# EAGLE design vending-machine-v2-optosensor-r1 (EAGLE 5.11)
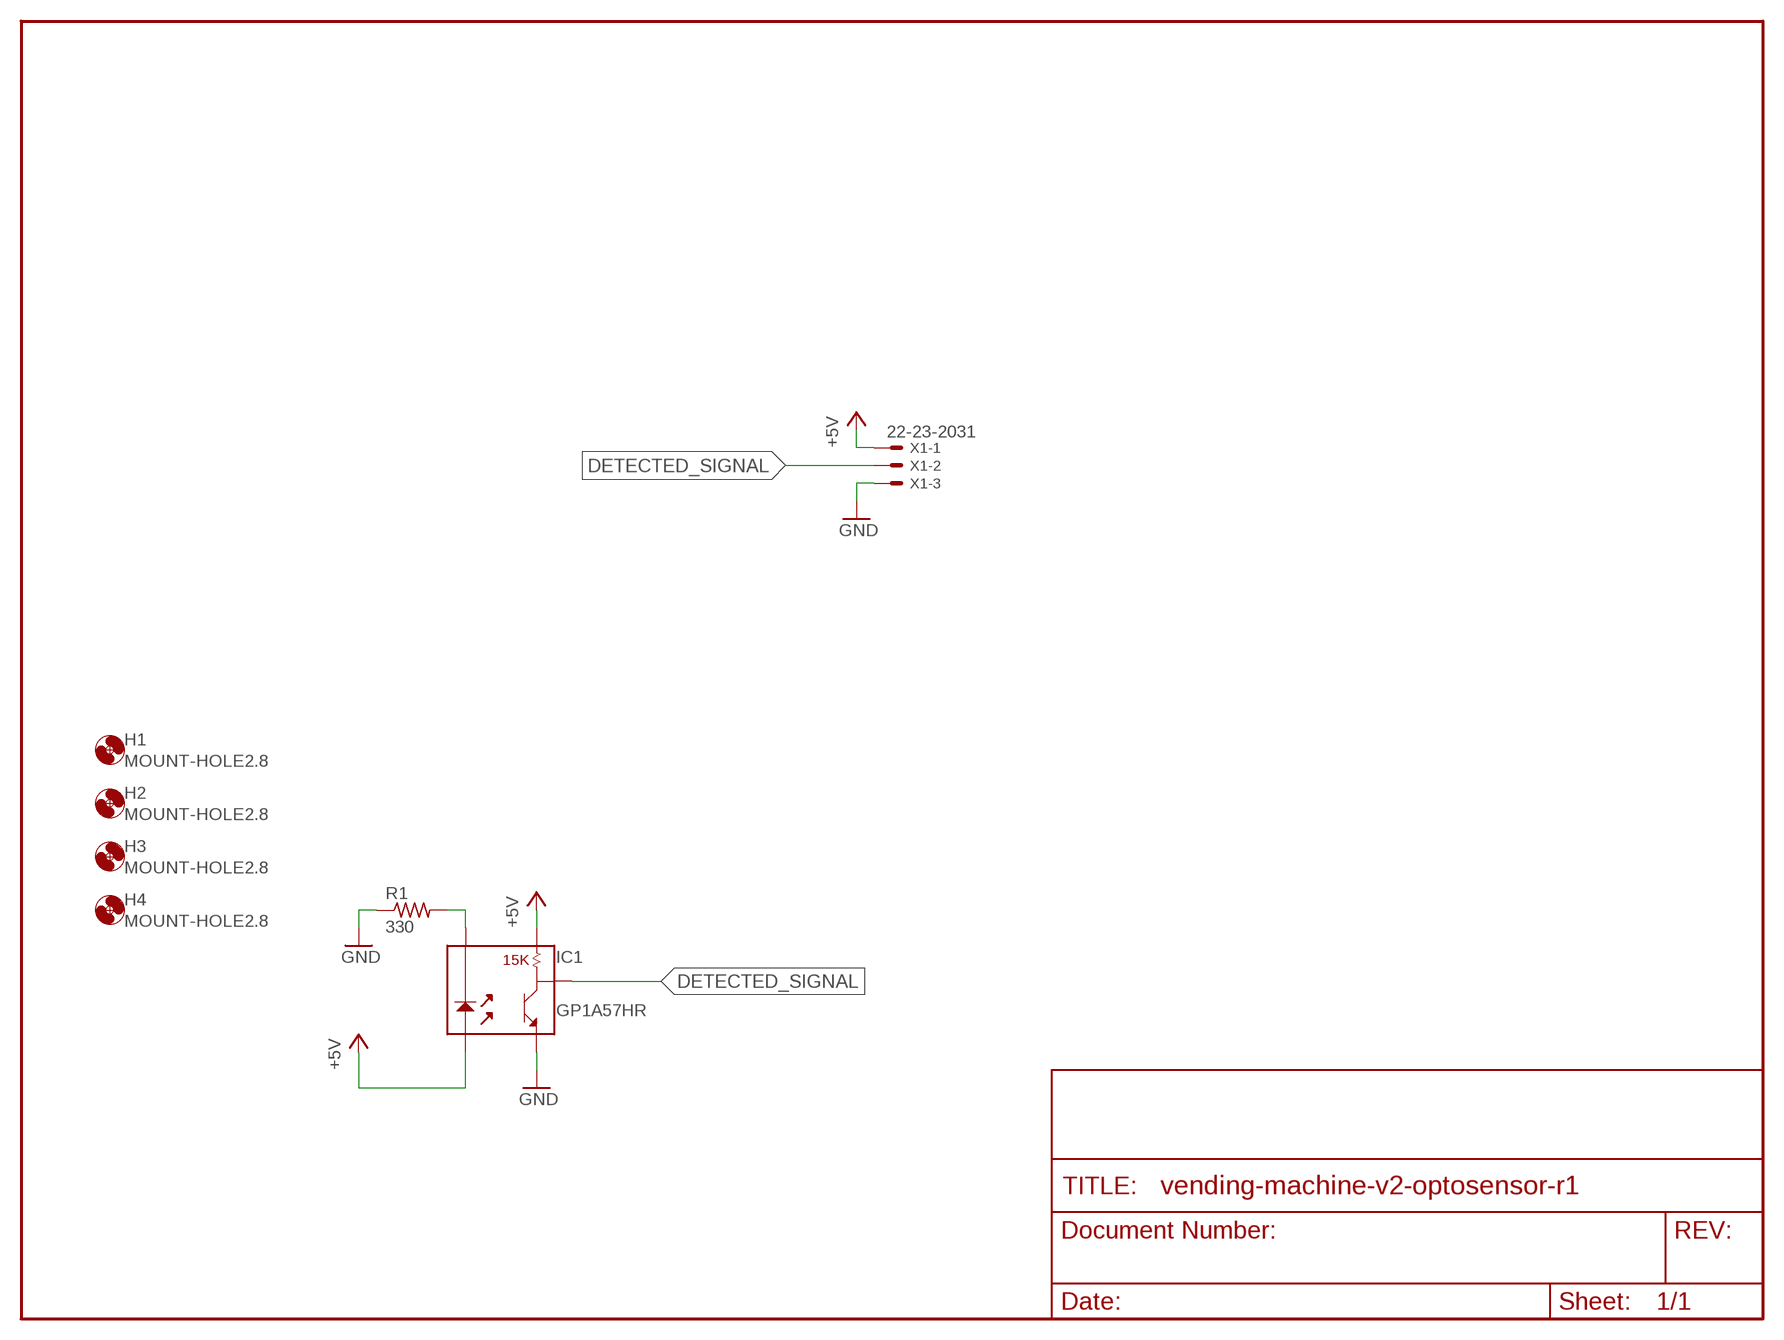
[diagram p0: schematic, sheet 1]

## Parts
H1  MOUNT-HOLE2.8  [2,8]
H2  MOUNT-HOLE2.8  [2,8]
H3  MOUNT-HOLE2.8  [2,8]
H4  MOUNT-HOLE2.8  [2,8]
IC1  GP1A57HR  [GP1A57HR]
R1  330  R-US_0204/5  [0204/5]
X1  22-23-2031  [22-23-2031]

## Nets
+5V: IC1.1 IC1.3 X1.1
DETECTED_SIGNAL: IC1.4 X1.2
GND: IC1.5 R1.1 X1.3
N$8: IC1.2 R1.2

## Library data of the parts
H1-H4 = holes:MOUNT-HOLE: MOUNTING HOLE with drill center marker
IC1 = SparkFun:GP1A57HR
R1 = rcl:R-US_: RESISTOR, American symbol
X1 = con-molex:22-23-2031: .100" (2.54mm) Center Header - 3 Pin; MF: MOLEX; MPN: 22-23-2031; OC_FARNELL: 1462950; OC_NEWARK: 30C0862

## Board
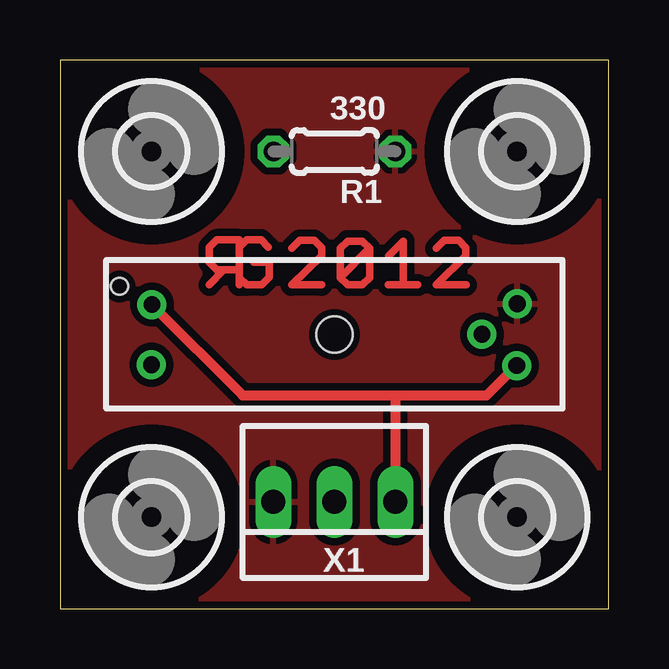
[diagram p1: board, top side]
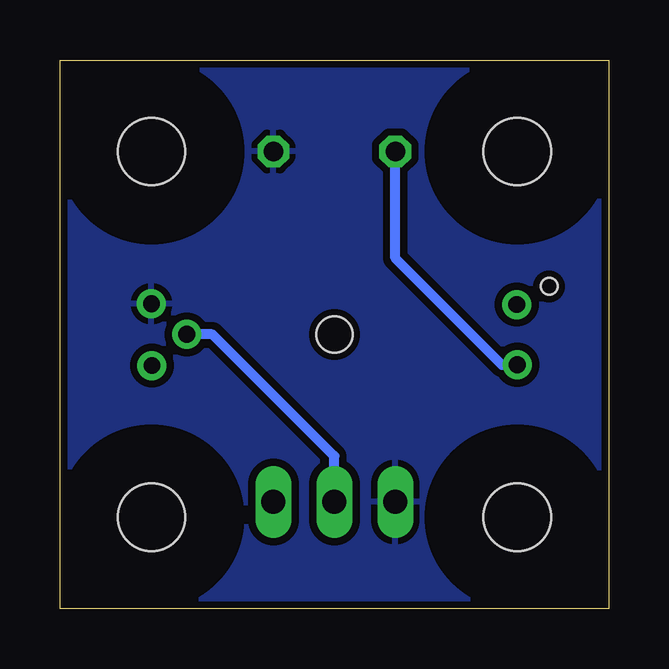
[diagram p2: board, bottom side, seen from below]

Size 22.86 x 22.86 mm. Coordinates in mm from the lower left corner, seen from the top.
Outline: 0,0 22.86,0 22.86,22.86 0,22.86 0,0
Copper layers (1*16): Top 0.035mm / dielectric 1.5mm / Bottom 0.035mm
Design rules "default *": minimum track width 10mil, minimum drill 24mil, track to track 8mil, track to pad 8mil, pad to pad 8mil, via to via 8mil, smd to smd 8mil, copper to edge 10mil, drill to drill 8mil, minimum pad ring 10mil, minimum via ring 8mil, stop-mask expansion 4mil, vias tented up to drill 0mil, thermal gap 10mil

### Footprints (pad centres in the part's own frame; a part is rotated, then mirrored left to right if it is on the bottom)
2,8 = hole 2.8: 0,0
GP1A57HR = drill 0.7 round: 1 -7.6,1.24; 2 -7.62,-1.27; 3 7.6,-1.3; 4 6.15,0; 5 7.62,1.27 | hole 1.5: 0,0 | hole 0.7: -8.95,2
0204/5 = drill 0.813 octagon: 1 -2.54,0; 2 2.54,0
22-23-2031 = drill 1 long: 1 -2.54,0; 2 0,0; 3 2.54,0

### Placement (x,y rotation side)
H1  3.81,19.05 0 top
H2  19.05,19.05 0 top
H3  19.05,3.81 0 top
H4  3.81,3.81 0 top
IC1  11.43,11.43 0 top
R1  11.43,19.05 180 top
U$1  [RGLOGO_SMALL_2012]  7.62,13.34 0 top
X1  11.43,4.45 180 top

### Tracks (layer width: path | path; a pad name or v marks a point on that pad's centre or on a via)
+5V
  Top 0.406: IC1.3 17.78,8.89 13.97,8.89 | 13.97,8.89 7.61,8.89 IC1.1 | 13.97,8.89 X1.1
DETECTED_SIGNAL
  Bottom 0.406: IC1.4 16.51,11.43 11.43,6.35 X1.2
GND
  pour Bottom (isolate 0.305): 0,22.86 22.86,22.86 22.86,0 0,0
  pour Top (isolate 0.305): 0,22.86 22.86,22.86 22.86,0 0,0
N$8
  Bottom 0.406: IC1.2 4.45,10.16 8.89,14.61 R1.2

### Text on the board
_tsilk: 330 | R1 | X1